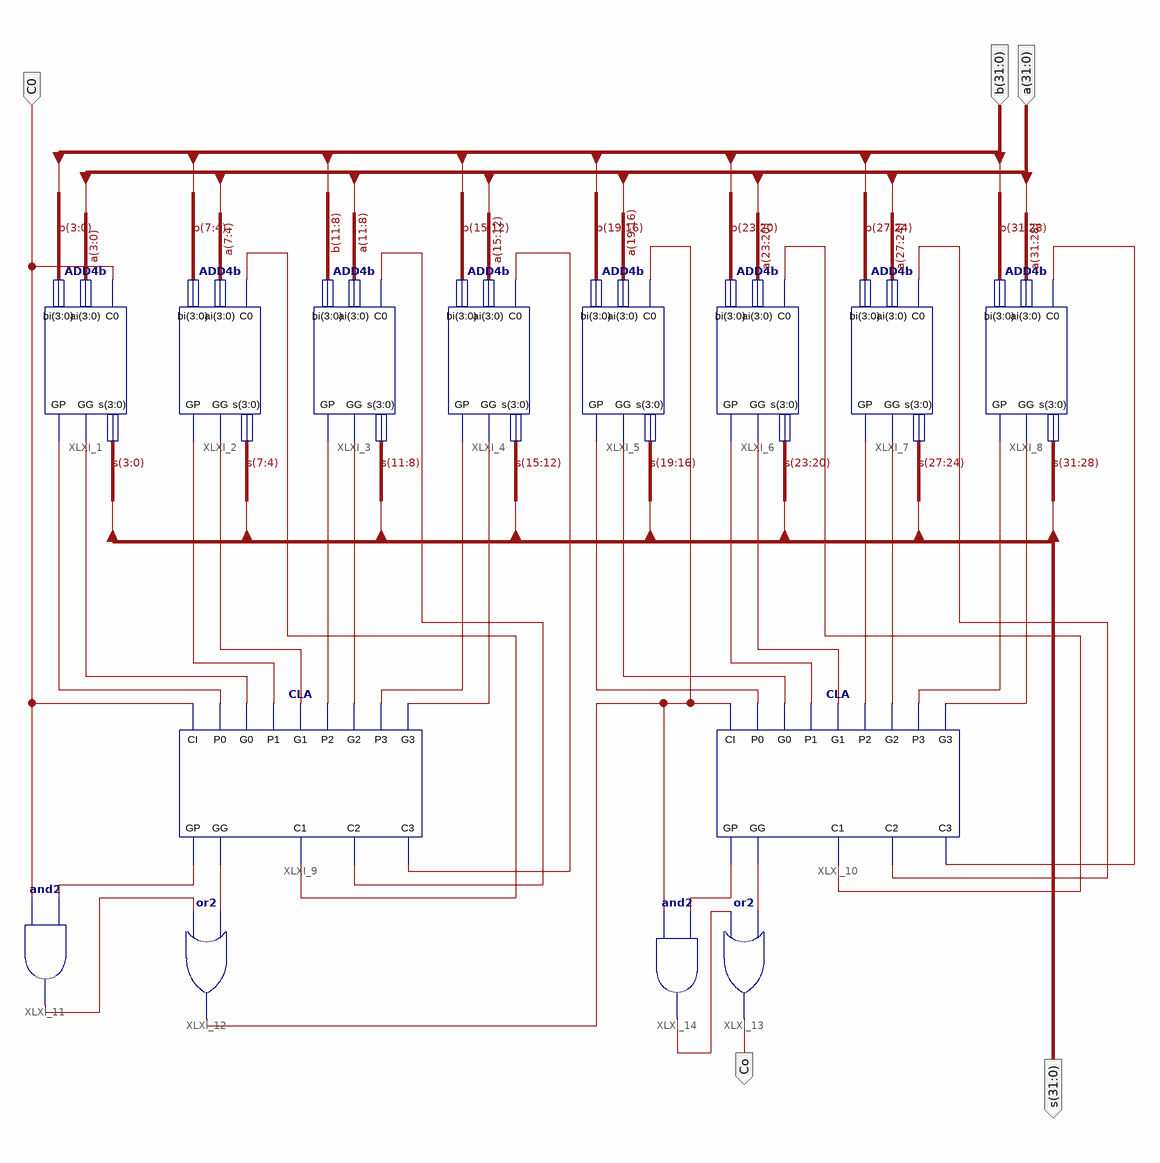
[diagram p0: schematic sheet 1]
// Xilinx ISE schematic ADC32.sch (kintex7) as structural Verilog: 14 symbols, 5 ports
module ADC32 (
  input  [31:0] b,
  input  [31:0] a,
  input  C0,
  output [31:0] s,
  output Co
);

  wire XLXN_33, XLXN_34, XLXN_35, XLXN_36, XLXN_37, XLXN_38, XLXN_39, XLXN_40, XLXN_51, XLXN_54, XLXN_55,
       XLXN_56, XLXN_57, XLXN_58, XLXN_60, XLXN_61, XLXN_62, XLXN_63, XLXN_64, XLXN_65, XLXN_66, XLXN_67,
       XLXN_71, XLXN_74, XLXN_79, XLXN_81, XLXN_89, XLXN_90, XLXN_91;

  ADD4b XLXI_1 (.ai(a[3:0]), .bi(b[3:0]), .C0(C0), .GG(XLXN_39), .GP(XLXN_40), .s(s[3:0]));
  ADD4b XLXI_2 (.ai(a[7:4]), .bi(b[7:4]), .C0(XLXN_55), .GG(XLXN_37), .GP(XLXN_38), .s(s[7:4]));
  ADD4b XLXI_3 (.ai(a[11:8]), .bi(b[11:8]), .C0(XLXN_54), .GG(XLXN_35), .GP(XLXN_36), .s(s[11:8]));
  ADD4b XLXI_4 (.ai(a[15:12]), .bi(b[15:12]), .C0(XLXN_51), .GG(XLXN_33), .GP(XLXN_34), .s(s[15:12]));
  ADD4b XLXI_5 (.ai(a[19:16]), .bi(b[19:16]), .C0(XLXN_81), .GG(XLXN_66), .GP(XLXN_67), .s(s[19:16]));
  ADD4b XLXI_6 (.ai(a[23:20]), .bi(b[23:20]), .C0(XLXN_79), .GG(XLXN_64), .GP(XLXN_65), .s(s[23:20]));
  ADD4b XLXI_7 (.ai(a[27:24]), .bi(b[27:24]), .C0(XLXN_74), .GG(XLXN_62), .GP(XLXN_63), .s(s[27:24]));
  ADD4b XLXI_8 (.ai(a[31:28]), .bi(b[31:28]), .C0(XLXN_71), .GG(XLXN_60), .GP(XLXN_61), .s(s[31:28]));
  CLA XLXI_9 (
    .CI(C0), .G0(XLXN_39), .G1(XLXN_37), .G2(XLXN_35), .G3(XLXN_33), .P0(XLXN_40), .P1(XLXN_38),
    .P2(XLXN_36), .P3(XLXN_34), .C1(XLXN_55), .C3(XLXN_51), .C2(XLXN_54), .GG(XLXN_58), .GP(XLXN_56));
  CLA XLXI_10 (
    .CI(XLXN_81), .G0(XLXN_66), .G1(XLXN_64), .G2(XLXN_62), .G3(XLXN_60), .P0(XLXN_67), .P1(XLXN_65),
    .P2(XLXN_63), .P3(XLXN_61), .C1(XLXN_79), .C3(XLXN_71), .C2(XLXN_74), .GG(XLXN_91), .GP(XLXN_89));
  and XLXI_11 (XLXN_57, C0, XLXN_56);
  or XLXI_12 (XLXN_81, XLXN_57, XLXN_58);
  or XLXI_13 (Co, XLXN_90, XLXN_91);
  and XLXI_14 (XLXN_90, XLXN_81, XLXN_89);
endmodule
